# Altium schematic sheet current_signal_adaptation_3.SchDoc
size A4; SheetNumber: 5; SheetTotal: 12
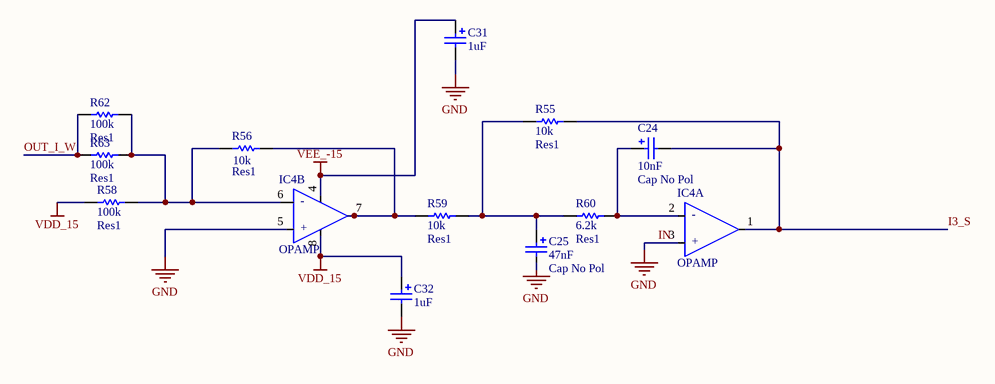
[diagram p0: current_signal_adaptation_3.SchDoc]

## Parts
C24  Cap No Pol  value 10nF  [RAD-0.1]
C25  Cap No Pol  value 47nF  [RAD-0.1]
C31  value 1uF  [RAD-0.1]  (hidden comment: Cap No Pol)
C32  value 1uF  [RAD-0.1]  (hidden comment: Cap No Pol)
IC4  OPAMP  [DIP-8]  (parts A,B of 2)
R55  Res1  value 10k  [AXIAL-0.4]
R56  Res1  value 10k  [AXIAL-0.4]
R58  Res1  value 100k  [AXIAL-0.4]
R59  Res1  value 10k  [AXIAL-0.4]
R60  Res1  value 6.2k  [AXIAL-0.4]
R62  Res1  value 100k  [AXIAL-0.4]
R63  Res1  value 100k  [AXIAL-0.4]

## Nets
IN: C25.2 C31.2 C32.2 IC4.3(IN_A_+) IC4.5(IN_B_+)  [also labelled GND]
VDD_15: C32.1 IC4.8(V+) R58.1
VEE_-15: C31.1 IC4.4(-V)
I3_S: C24.2 IC4.1(OUT_A) R55.2
OUT_I_W: R62.1 R63.1
NetC24_1: C24.1 IC4.2(IN_A_-) R60.2
NetC25_1: C25.1 R55.1 R59.2 R60.1
NetIC4_7: IC4.7(OUT_B) R56.2 R59.1
NetR56_1: R56.1 R58.2 R62.2 R63.2

Not connected (* = marked no-connect by the designer): IC4 6(IN_B_-)

## Notes on the sheet
- (in symbol ADTL082, part A) -; +
- (in symbol ADTL082, part B) -; +

## Library data of the parts
C24 C25 C31 C32 = Cap No Pol: Polarized Capacitor (Radial); Published: 8-Jun-2000; LatestRevisionDate: 17-Jul-2002; LatestRevisionNote: Re-released for DXP Platform.; PackageReference: RB7.6-15; Publisher: Altium Limited; PackageDescription: Polarized Capacitor (Radial); 2 Leads
IC4 = ADTL082
R55 R56 R58-R60 R62 R63 = Res1: Resistor; Published: 8-Jun-2000; LatestRevisionDate: 17-Jul-2002; LatestRevisionNote: Re-released for DXP Platform.; PackageReference: AXIAL-0.3; Publisher: Altium Limited; PackageDescription: Axial Device, Thru-Hole; 2 Leads; 0.3 in Pin Spacing